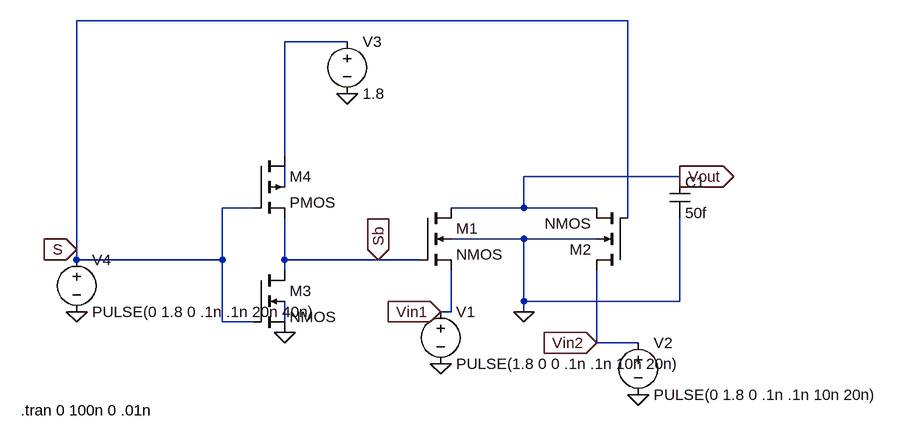
[diagram p0: schematic mux.asc]
mux.asc, the LTspice schematic file:
Version 4
SHEET 1 880 680
WIRE 272 -288 -576 -288
WIRE -160 -256 -256 -256
WIRE -256 -80 -256 -256
WIRE 352 -48 112 -48
WIRE -256 -32 -256 -64
WIRE -304 0 -352 0
WIRE 112 0 112 -48
WIRE 112 0 0 0
WIRE 224 0 112 0
WIRE 272 16 272 -288
WIRE 112 48 0 48
WIRE 224 48 112 48
WIRE -576 64 -576 -288
WIRE -576 80 -576 64
WIRE -352 80 -352 0
WIRE -352 80 -576 80
WIRE -256 80 -256 16
WIRE -112 80 -256 80
WIRE -48 80 -112 80
WIRE -256 96 -256 80
WIRE 112 144 112 48
WIRE 352 144 352 16
WIRE 352 144 112 144
WIRE 0 160 0 96
WIRE 0 160 -16 160
WIRE 112 160 112 144
WIRE -352 176 -352 80
WIRE -304 176 -352 176
WIRE -256 176 -256 144
WIRE 224 208 224 96
WIRE 288 208 224 208
FLAG 112 160 0
FLAG -160 -176 0
FLAG -256 192 0
FLAG -576 160 0
FLAG -16 240 0
FLAG 288 288 0
FLAG 352 -48 Vout
IOPIN 352 -48 Out
FLAG -576 64 S
IOPIN -576 64 In
FLAG -16 160 Vin1
IOPIN -16 160 In
FLAG 224 208 Vin2
IOPIN 224 208 In
FLAG -112 80 Sb
IOPIN -112 80 In
SYMBOL nmos4 -48 0 R0
SYMATTR InstName M1
SYMATTR Value2 l=180nm w=270nm
SYMBOL nmos4 -304 96 R0
SYMATTR InstName M3
SYMATTR Value2 l=180nm w=270nm
SYMBOL pmos4 -304 -80 R0
SYMATTR InstName M4
SYMATTR Value2 l=180nm w=810nm
SYMBOL nmos4 272 96 R180
SYMATTR InstName M2
SYMATTR Value2 l=180nm w=270nm
SYMBOL cap 336 -48 R0
SYMATTR InstName C1
SYMATTR Value 50f
SYMBOL voltage -16 144 R0
WINDOW 123 0 0 Left 0
WINDOW 39 0 0 Left 0
SYMATTR InstName V1
SYMATTR Value PULSE(1.8 0 0 .1n .1n 10n 20n)
SYMBOL voltage 288 192 R0
WINDOW 123 0 0 Left 0
WINDOW 39 0 0 Left 0
SYMATTR InstName V2
SYMATTR Value PULSE(0 1.8 0 .1n .1n 10n 20n)
SYMBOL voltage -160 -272 R0
WINDOW 123 0 0 Left 0
WINDOW 39 0 0 Left 0
SYMATTR InstName V3
SYMATTR Value 1.8
SYMBOL voltage -576 64 R0
WINDOW 123 0 0 Left 0
WINDOW 39 0 0 Left 0
SYMATTR InstName V4
SYMATTR Value PULSE(0 1.8 0 .1n .1n 20n 40n)
TEXT -662 312 Left 2 !.tran 0 100n 0 .01n

The netlist it stands for:
* mux.asc
M1 Vout Sb Vin1 0 NMOS l=180nm w=270nm
M3 Sb S 0 N003 NMOS l=180nm w=270nm
M4 N001 S Sb N002 PMOS l=180nm w=810nm
M2 Vin2 S Vout 0 NMOS l=180nm w=270nm
C1 Vout 0 50f
V1 Vin1 0 PULSE(1.8 0 0 .1n .1n 10n 20n)
V2 Vin2 0 PULSE(0 1.8 0 .1n .1n 10n 20n)
V3 N001 0 1.8
V4 S 0 PULSE(0 1.8 0 .1n .1n 20n 40n)
.model NMOS NMOS
.model PMOS PMOS
.lib standard.mos
.tran 0 100n 0 .01n
.backanno
.end